# Altium schematic sheet Project Architecture.SchDoc
size 420 x 297 mm
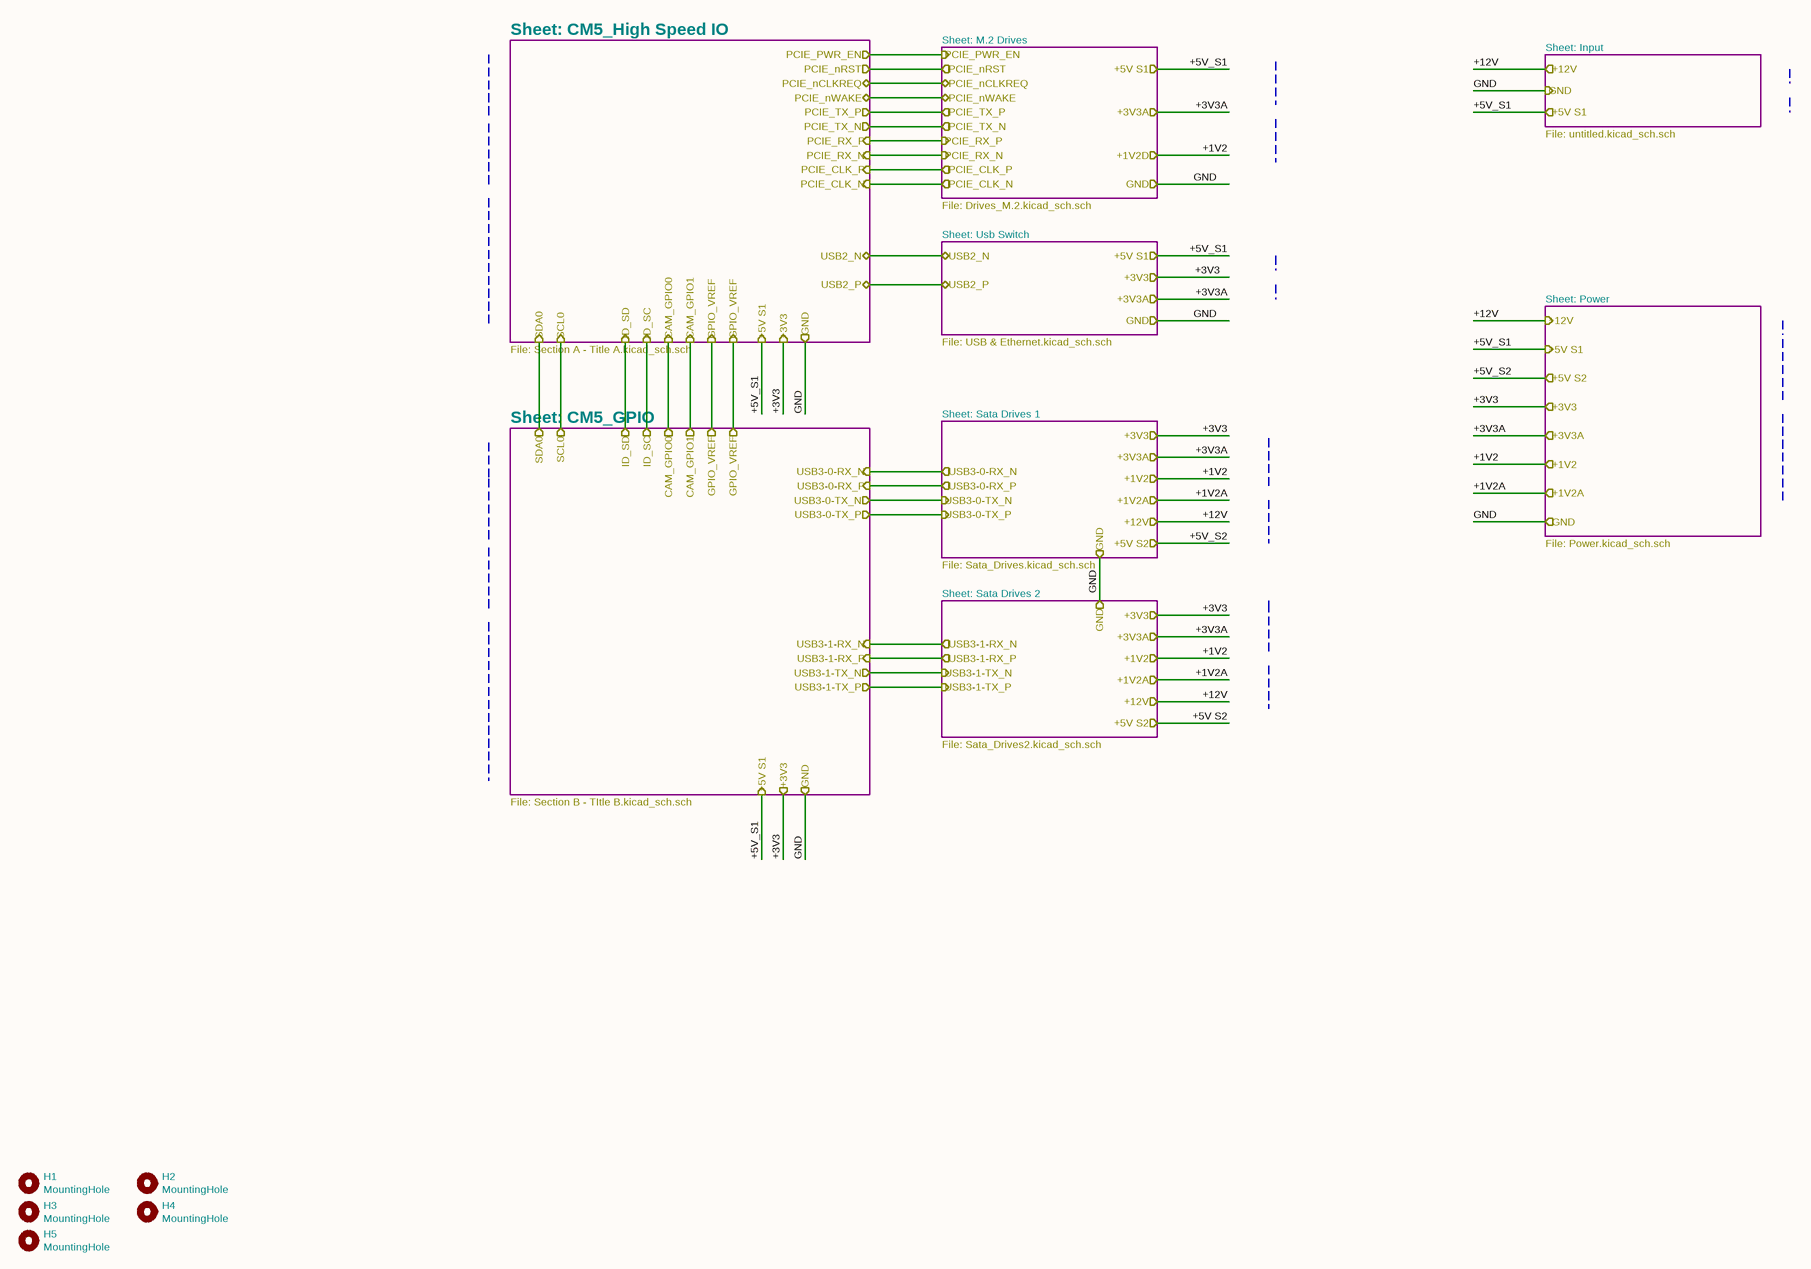
[diagram p0: Project Architecture.SchDoc]

## Parts
H1  MountingHole  [MountingHole_2.7mm_M2.5]
H2  MountingHole  [MountingHole_2.7mm_M2.5]
H3  MountingHole  [MountingHole_2.7mm_M2.5]
H4  MountingHole  [MountingHole_2.7mm_M2.5]
H5  MountingHole  [MountingHole_2.7mm_M2.5]

## Sub-sheets
CM5_GPIO = Section B - TItle B.SchDoc: no entries
CM5_High Speed IO = Section A - Title A.SchDoc: no entries
Input = untitled.SchDoc: no entries
M.2 Drives = Drives_M.2.SchDoc: no entries
Power = Power.SchDoc: no entries
Sata Drives 1 = Sata_Drives.SchDoc: no entries
Sata Drives 2 = Sata_Drives2.SchDoc: no entries
Usb Switch = USB & Ethernet.SchDoc: no entries

## Ports
+1V2 (in), +1V2A (in), +1V2D (in), +3V3 (in), +3V3 (out), +3V3A (in), +5V S1 (in), +5V S1 (out), +5V S2 (in), +12V (in), +12V (out), CAM_GPIO0 (in), CAM_GPIO0 (out), CAM_GPIO1 (in), CAM_GPIO1 (out), GND (in), GND (out), GPIO_VREF (in), GPIO_VREF (out), ID_SC (in), ID_SC (out), ID_SD (in), ID_SD (out), PCIE_CLK_N (in), PCIE_CLK_N (out), PCIE_CLK_P (in), PCIE_CLK_P (out), PCIE_nCLKREQ (bidir), PCIE_nRST (in), PCIE_nWAKE (bidir), PCIE_PWR_EN (in), PCIE_PWR_EN (out), PCIE_RX_N (out), PCIE_RX_P (out), PCIE_TX_N (in), PCIE_TX_P (in), SCL0 (in), SCL0 (out), SDA0 (in), SDA0 (out), USB2_N (bidir), USB2_P (bidir), USB3-0-RX_N (in), USB3-0-RX_N (out), USB3-0-RX_P (in), USB3-0-RX_P (out), USB3-0-TX_N (in), USB3-0-TX_N (out), USB3-0-TX_P (in), USB3-0-TX_P (out), USB3-1-RX_N (in), USB3-1-RX_N (out), USB3-1-RX_P (in), USB3-1-RX_P (out), USB3-1-TX_N (in), USB3-1-TX_N (out), USB3-1-TX_P (in), USB3-1-TX_P (out)

## Nets
+1V2: port +1V2, port +1V2D
+1V2A: port +1V2A
+3V3: port +3V3
+3V3A: port +3V3A
+5V S2: port +5V S2  [also labelled +5V_S2]
+5V_S1: port +5V S1
+12V: port +12V
GND: port GND

## Notes on the sheet
- Sheet: CM5_High Speed IO
- Sheet: M.2 Drives
- Sheet: Input
- File: untitled.kicad_sch.sch
- File: Drives_M.2.kicad_sch.sch
- Sheet: Usb Switch
- Sheet: Power
- File: Section A - Title A.kicad_sch.sch
- File: USB & Ethernet.kicad_sch.sch
- Sheet: CM5_GPIO
- Sheet: Sata Drives 1
- File: Power.kicad_sch.sch
- Sheet: Sata Drives 2
- File: Sata_Drives.kicad_sch.sch
- File: Sata_Drives2.kicad_sch.sch
- File: Section B - TItle B.kicad_sch.sch
- 1
- 2
- 3
- 4
- 5
- 6
- 7
- 8
- A
- B
- C
- D
- E
- Title: Project Architecture
- File: Project Architecture.kicad_sch
- Sheet: /
- ${COMPANY}
- F
- KiCad E.D.A.  kicad (5.1.4)-1
- Size: A3
- Date: Last Modified Date
- Rev: ${REVISION}
- Id: 1/1

## Library data of the parts
H1-H5 = MountingHole: Part Description: M2.5 mounting hole; Field4: nf; Field5: nf; Field6: nf; Field7: nf; Value: MountingHole; Footprint: MountingHole:MountingHole_2.7mm_M2.5